# Altium schematic sheet MUX.SchDoc
size 420 x 297 mm
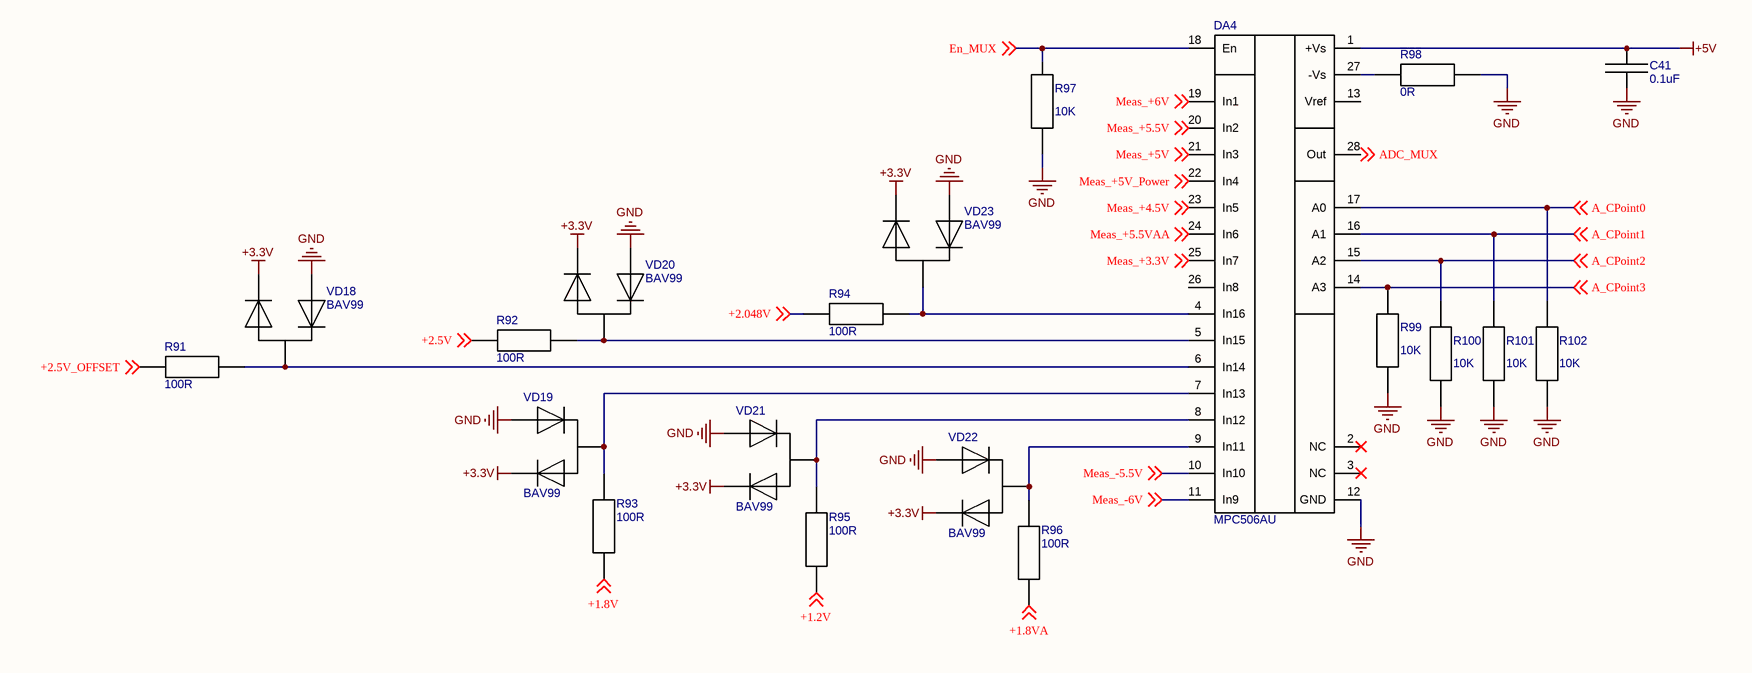
[diagram p0: MUX.SchDoc]

## Parts
C41  0.1uF  [0603C]
DA4  MPC506AU  [SOIC-28]
R91  100R  [R0402]
R92  100R  [R0402]
R93  100R  [R0402]
R94  100R  [R0402]
R95  100R  [R0402]
R96  100R  [R0402]
R97  10K  [R0402]
R98  0R  [R0402]
R99  10K  [R0402]
R100  10K  [R0402]
R101  10K  [R0402]
R102  10K  [R0402]
VD18  BAV99  [SOT-23-3]
VD19  BAV99  [SOT-23-3]
VD20  BAV99  [SOT-23-3]
VD21  BAV99  [SOT-23-3]
VD22  BAV99  [SOT-23-3]
VD23  BAV99  [SOT-23-3]

## Nets
+3.3V: VD18.2 VD19.2 VD20.2 VD21.2 VD22.2 VD23.2
+5V: C41.1 DA4.1(+Vs)
GND: C41.2 DA4.12(GND) R97.2 R98.1 R99.1 R100.1 R101.1 R102.1 VD18.1 VD19.1 VD20.1 VD21.1 VD22.1 VD23.1
+1.2V: R95.1 ; off-sheet +1.2V
+1.8V: R93.1 ; off-sheet +1.8V
+1.8VA: R96.1 ; off-sheet +1.8VA
+2.5V: R92.1 ; off-sheet +2.5V
+2.5V_OFFSET: R91.1 ; off-sheet +2.5V_OFFSET
+2.048V: R94.1 ; off-sheet +2.048V
A_CPoint0: DA4.17(A0) R102.2 ; off-sheet A_CPoint0
A_CPoint1: DA4.16(A1) R101.2 ; off-sheet A_CPoint1
A_CPoint2: DA4.15(A2) R100.2 ; off-sheet A_CPoint2
A_CPoint3: DA4.14(A3) R99.2 ; off-sheet A_CPoint3
ADC_MUX: DA4.28(Out) ; off-sheet ADC_MUX
En_MUX: DA4.18(En) R97.1 ; off-sheet En_MUX
Meas_+3.3V: DA4.25(In7) ; off-sheet Meas_+3.3V
Meas_+4.5V: DA4.23(In5) ; off-sheet Meas_+4.5V
Meas_+5.5V: DA4.20(In2) ; off-sheet Meas_+5.5V
Meas_+5.5VAA: DA4.24(In6) ; off-sheet Meas_+5.5VAA
Meas_+5V: DA4.21(In3) ; off-sheet Meas_+5V
Meas_+5V_Power: DA4.22(In4) ; off-sheet Meas_+5V_Power
Meas_+6V: DA4.19(In1) ; off-sheet Meas_+6V
Meas_-5.5V: DA4.10(In10) ; off-sheet Meas_-5.5V
Meas_-6V: DA4.11(In9) ; off-sheet Meas_-6V
NetDA4_4: DA4.4(In16) R94.2 VD23.3
NetDA4_5: DA4.5(In15) R92.2 VD20.3
NetDA4_6: DA4.6(In14) R91.2 VD18.3
NetDA4_7: DA4.7(In13) R93.2 VD19.3
NetDA4_8: DA4.8(In12) R95.2 VD21.3
NetDA4_9: DA4.9(In11) R96.2 VD22.3
NetDA4_27: DA4.27(-Vs) R98.2

Not connected (* = marked no-connect by the designer): DA4 2(NC)* 3(NC)* 13(Vref) 26(In8)

## Notes on the sheet
- Подп. и дата
- Инв.№ дубл.
- Взам.инв.№
- Подп.и дата
- Инв.№ подл.
- Изм.
- Лист
- № докум.
- Подп.
- Дата
- Формат  A3

## Library data of the parts
C41 = C0603-0.1UF 10% 50V: C0603 0.1UF 10% 50V; Part Number: SMD CAP CER 0.1UF ±10% 50V X7R 0603; Added_by: anton@teslatec.ru; Solder_Amount: 2; Pkg: 0603; Created_at: 10/01/2023; MountType: SMD; Mount: MOUNT
DA4 = MPC506AU: MPC506AU, Ch: 16, SO28; Added_by: irdolgopolowa@yandex.ru; Solder_Amount: 28; Mount: MOUNT; MountType: SMD/SMT; Part Number: MPC506A; Created_at: 29/10/2024; Pkg: SOIC-28
R91-R96 = R0402-100R: Resistor SMD 100R 1% 0402; Part Number: SMD RES 100 OHM 1% ±100ppm/°C 0402; Added_by: irdolgopolowa@yandex.ru; Solder_Amount: 2; Pkg: 0402; Created_at: 29/10/24; MountType: SMD; Mount: MOUNT
R97 R99-R102 = R0402-10K: Resistor SMD 10K 1% 0402; Part Number: SMD RES 10 KOHM 1% ±100ppm/°C 0402; Added_by: Rutel@teslatec.ru; Solder_Amount: 2; Pkg: 0402; Created_at: 21/04/2020; MountType: SMD; Mount: MOUNT
R98 = R0402-0R: Resistor SMD 0R 1% 0402; Part Number: SMD RES 0R 0402; Added_by: irdolgopolowa@yandex.ru; Solder_Amount: 2; Pkg: 0402; Created_at: 29/10/24; MountType: SMD; Mount: MOUNT
VD18-VD23 = BAV99: BAV99, UMW, 70В, 200мА; Added_by: andrew@teslatec.ru; Solder_Amount: 3; Created_at: 29/06/2020; Mount: MOUNT; MountType: SMD; Pkg: SOT-23-3; Part Number: BAV99